# EAGLE design Wattuino-Nanite841_v10 (EAGLE 7.7.0)
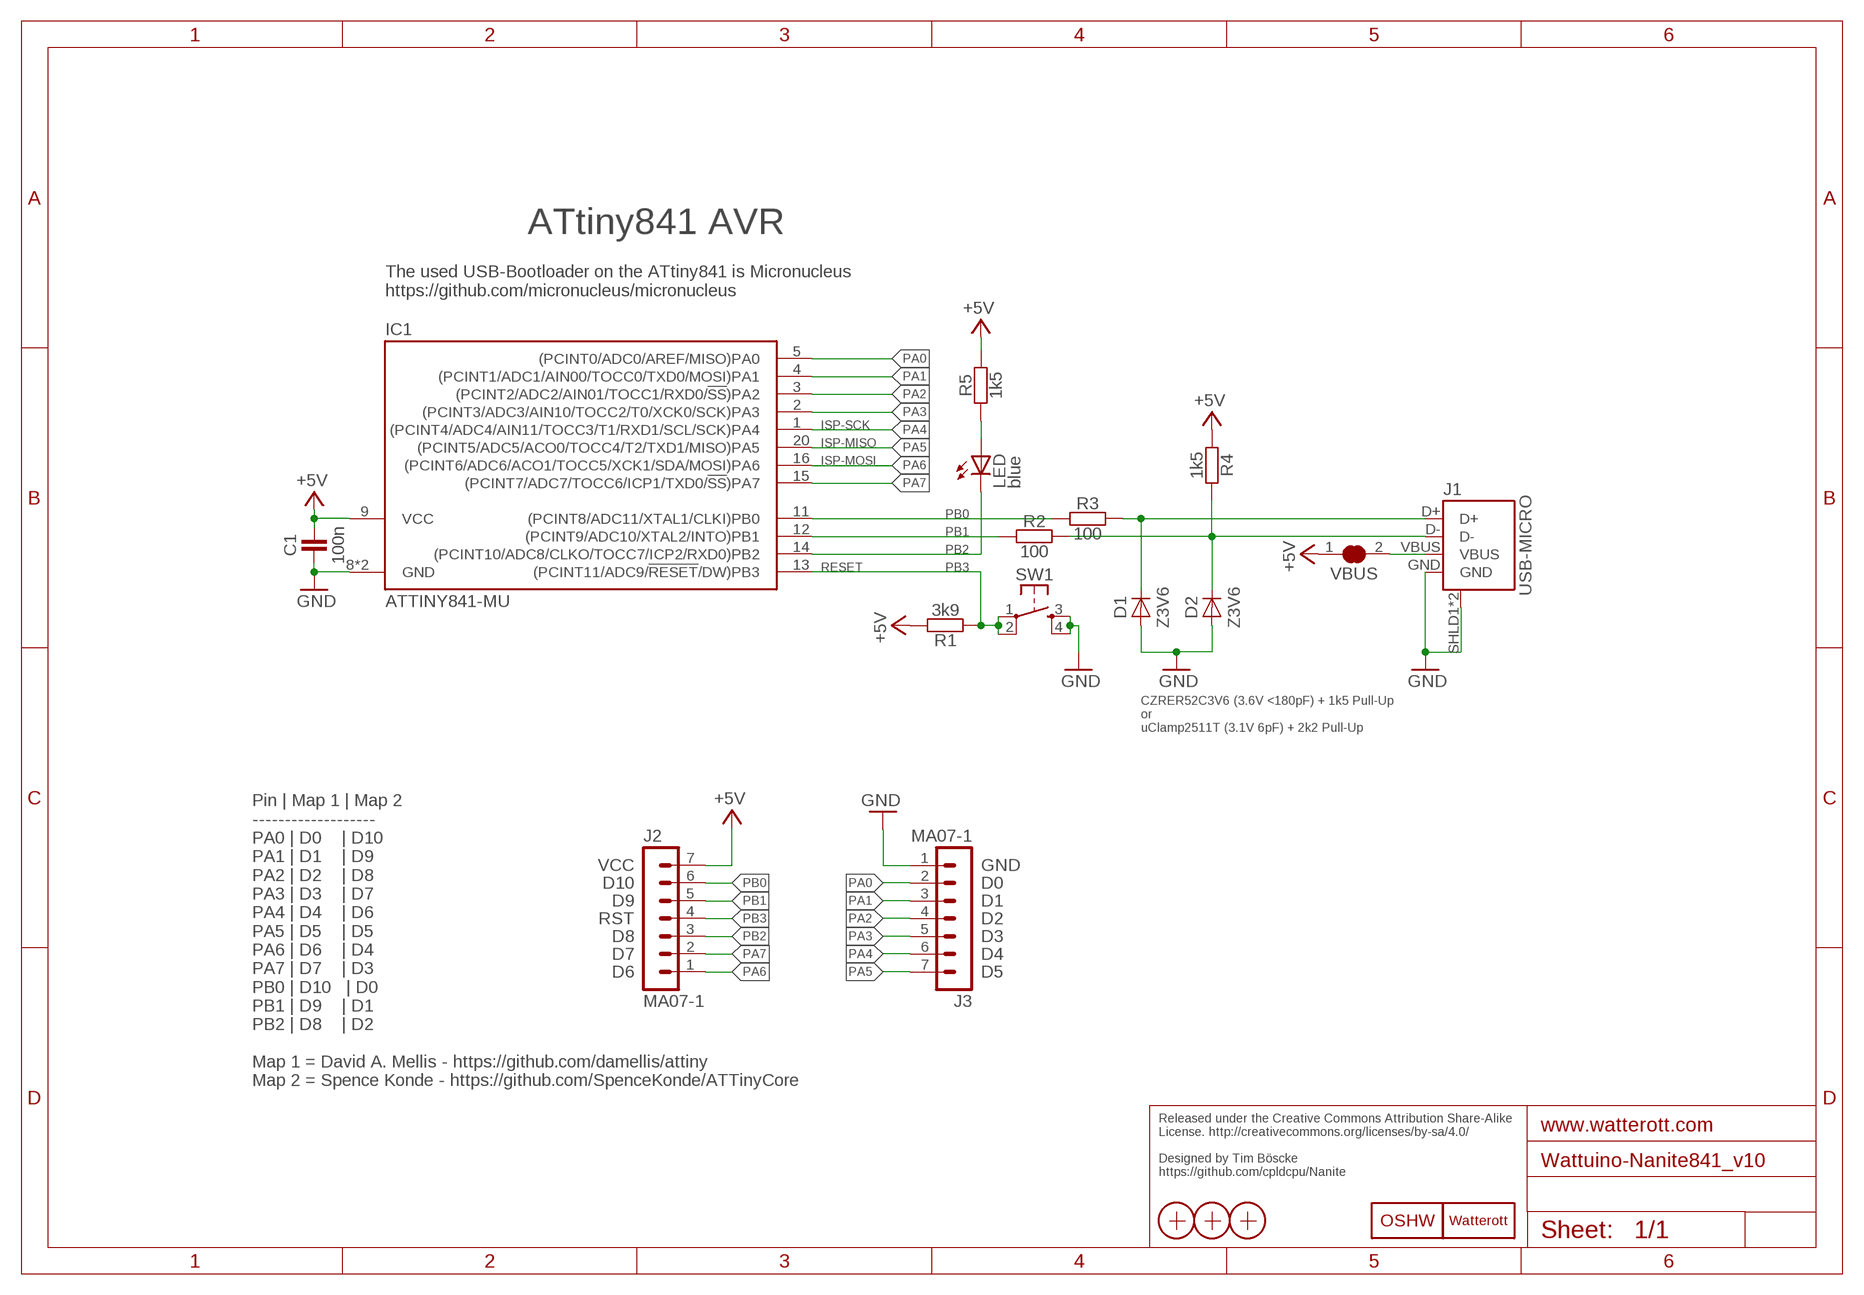
[diagram p0: schematic, sheet 1]

## Parts
C1  100n  CAPACITOR-0402  [C0402]
D1  Z3V6  DIODE-SOD882  [SOD882]
D2  Z3V6  DIODE-SOD882  [SOD882]
IC1  ATTINY841-MU  [QFN20-PAD]
J1  USB-MICRO  [USB-MICRO-10103594]
J2  MA07-1  [MA07-1]
J3  MA07-1  [MA07-1]
LED  blue  LED-0603  [C0603]
LOGO1  LOGO-S_PLACE_S  [SPARK_TPLACE_S]
LOGO2  OSHW_LOGOX0070  [OSHW_6X70]
R1  3k9  RESISTOR-0402  [C0402]
R2  100  RESISTOR-0402  [C0402]
R3  100  RESISTOR-0402  [C0402]
R4  1k5  RESISTOR-0402  [C0402]
R5  1k5  RESISTOR-0402  [C0402]
SW1  SW-TACTILE-PTS840P  [SW_PTS840P]
VBUS  JUMPER2-0603-NC  [JUMPER2-0603_NC]
X1  PASSER-07  [PASSER_07MM]
X2  PASSER-07  [PASSER_07MM]
X3  PASSER-07  [PASSER_07MM]

## Nets
+5V: C1.2 IC1.9(VCC) J2.7 R1.2 R4.1 R5.2 VBUS.1
D_N: D2.C J1.D- R2.2 R4.2
D_P: D1.C J1.D+ R3.2
GND: C1.1 D1.A D2.A IC1.8(GND) IC1.TP(GND) J1.GND J1.SHLD1(SHIELD) J1.SHLD2(SHIELD) J3.1 SW1.3(S1) SW1.4(S2)
LED+: LED.A R5.1
PA0: IC1.5((PCINT0/ADC0/AREF/MISO)PA0) J3.2
PA1: IC1.4((PCINT1/ADC1/AIN00/TOCC0/TXD0/MOSI)PA1) J3.3
PA2: IC1.3((PCINT2/ADC2/AIN01/TOCC1/RXD0/!SS!)PA2) J3.4
PA3: IC1.2((PCINT3/ADC3/AIN10/TOCC2/T0/XCK0/SCK)PA3) J3.5
PA4: IC1.1((PCINT4/ADC4/AIN11/TOCC3/T1/RXD1/SCL/SCK)PA4) J3.6
PA5: IC1.20((PCINT5/ADC5/ACO0/TOCC4/T2/TXD1/MISO)PA5) J3.7
PA6: IC1.16((PCINT6/ADC6/ACO1/TOCC5/XCK1/SDA/MOSI)PA6) J2.1
PA7: IC1.15((PCINT7/ADC7/TOCC6/ICP1/TXD0/!SS!)PA7) J2.2
PB0: IC1.11((PCINT8/ADC11/XTAL1/CLKI)PB0) J2.6 R3.1
PB1: IC1.12((PCINT9/ADC10/XTAL2/INTO)PB1) J2.5 R2.1
PB2: IC1.14((PCINT10/ADC8/CLKO/TOCC7/ICP2/RXD0)PB2) J2.3 LED.C
PB3: IC1.13((PCINT11/ADC9/!RESET!/DW)PB3) J2.4 R1.1 SW1.1 SW1.2
VBUS: J1.VBUS VBUS.2

## Notes on the sheet
- ATtiny841 AVR
- The used USB-Bootloader on the ATtiny841 is Micronucleus 
  https://github.com/micronucleus/micronucleus
- ISP-SCK
- ISP-MISO
- ISP-MOSI
- RESET
- CZRER52C3V6 (3.6V <180pF) + 1k5 Pull-Up 
  or
  uClamp2511T (3.1V 6pF) + 2k2 Pull-Up
- Pin | Map 1 | Map 2
  -------------------
  PA0 | D0    | D10
  PA1 | D1    | D9
  PA2 | D2    | D8
  PA3 | D3    | D7
  PA4 | D4    | D6
  PA5 | D5    | D5
  PA6 | D6    | D4
  PA7 | D7    | D3
  PB0 | D10   | D0
  PB1 | D9    | D1
  PB2 | D8    | D2
  
  Map 1 = David A. Mellis - https://github.com/damellis/attiny
  Map 2 = Spence Konde - https://github.com/SpenceKonde/ATTinyCore
- VCC | GND
- D10 | D0
- D9 | D1
- RST | D2
- D8 | D3
- D7 | D4
- D6 | D5
- Released under the Creative Commons Attribution Share-Alike 
  License. http://creativecommons.org/licenses/by-sa/4.0/
  
  Designed by Tim Böscke
  https://github.com/cpldcpu/Nanite

## Library data of the parts
C1 = we-rcl:CAPACITOR: Capacitors ...4.7uF @ 6.3V -> 0402 ...10uF @ 16V -> 0603 ...22uF @ 25V -> 0805
D1 D2 = we-rcl:DIODE: Diodes
IC1 = we-chip:ATTINY841: Atmel ATtiny441/841 AVR Microcontroller
J1 = we-con:USB: USB Connectors; DIGIKEY: 609-4050-6-ND
J2 J3 = we-con:MA07-1: Pin Header
LED = we-opto:LED: LEDs
LOGO1 = we-symbol:LOGO: Watterott electronic Logo
LOGO2 = we-symbol:OSHW_LOGO: Open-Source-Hardware Logo
R1-R5 = we-rcl:RESISTOR: Resistors all kinds in 0603 and 0402
SW1 = we-switch:SW-TACTILE: Tactile Switches; DIGIKEY: CKN10511DKR-ND
VBUS = we-rcl:JUMPER2: 2 Pin Jumpers
X1-X3 = we-symbol:PASSER: Fiducial Markers

## Board
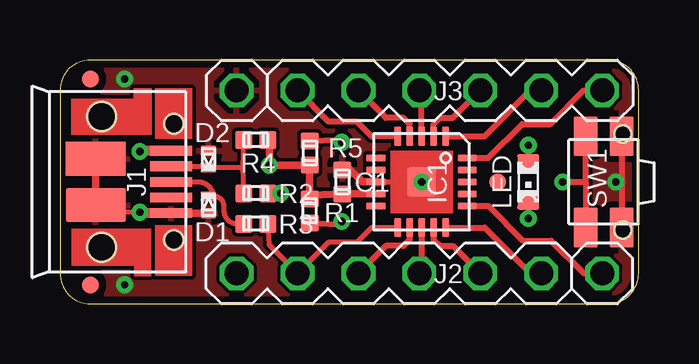
[diagram p1: board, top side]
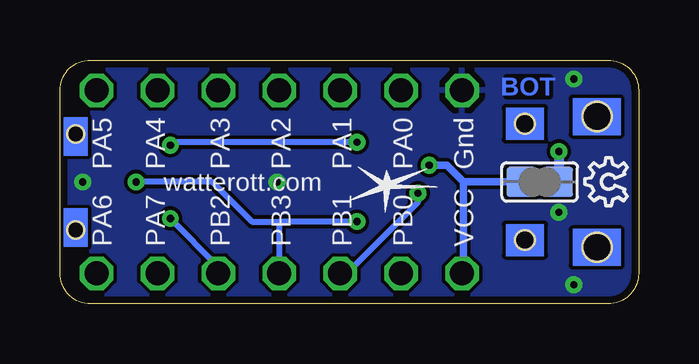
[diagram p2: board, bottom side, seen from below]

Size 24.13 x 10.16 mm. Coordinates in mm from the lower left corner, seen from the top.
Outline: 0,1.27 arc90 1.27,0 22.86,0 arc90 24.13,1.27 24.13,8.89 arc90 22.86,10.16 1.27,10.16 arc90 0,8.89 0,1.27
Copper layers (1*16): Top 0.035mm / dielectric 1.5mm / Bottom 0.035mm
Design rules "we-dru *": minimum track width 0.15mm, minimum drill 0.3mm, track to track 0.15mm, track to pad 0.15mm, pad to pad 0.15mm, via to via 0.15mm, smd to smd 0.1mm, copper to edge 0.3mm, drill to drill 0.2mm, minimum pad ring 0.18mm, minimum via ring 0.2mm, stop-mask expansion 0.1mm, vias tented up to drill 0.5mm, thermal gap 0.25mm

### Footprints (pad centres in the part's own frame; a part is rotated, then mirrored left to right if it is on the bottom)
C0402 = smd 0.75 x 0.7: 1 0,0.5; 2 0,-0.5
SOD882 = smd 0.65 x 0.4: A 0,-0.35; C 0,0.35
QFN20-PAD = smd 0.8 x 0.28: 1 -1.9,1; 2 -1.9,0.5; 3 -1.9,0; 4 -1.9,-0.5; 5 -1.9,-1; 11 1.9,-1; 12 1.9,-0.5; 13 1.9,0; 14 1.9,0.5; 15 1.9,1 | smd 0.28 x 0.8: 6 -1,-1.9; 7 -0.5,-1.9; 8 0,-1.9; 9 0.5,-1.9; 10 1,-1.9; 16 1,1.9; 17 0.5,1.9; 18 0,1.9; 19 -0.5,1.9; 20 -1,1.9 | smd 1.2 x 1.2: TP 0,0
USB-MICRO-10103594 = smd 1.8 x 0.4: D+ -2.885,0; D- -2.885,-0.65; GND -2.885,1.3; ID -2.885,0.65; VBUS -2.885,-1.3 | smd 2.5 x 1.425: SHLD1 0.25,-0.963; SHLD2 0.25,0.963 | hole 0.8: -3,2.425; -3,-2.425 | hole 1.2: 0.01,2.725; 0.01,-2.725
MA07-1 = drill 1 octagon: 1 0,7.62; 2 0,5.08; 3 0,2.54; 4 0,0; 5 0,-2.54; 6 0,-5.08; 7 0,-7.62
C0603 = smd 0.9 x 0.8: A 0,-0.75; C 0,0.75
SW_PTS840P = smd 1.65 x 1: 1 -1.9,0.75; 2 1.9,0.75; 3 -1.9,-0.75; 4 1.9,-0.75 | hole 0.7: -2,-0.8; 2,-0.8
JUMPER2-0603_NC = smd 1.25 x 1.25: 1 0,0.76; 2 0,-0.76
PASSER_07MM = smd 0.7 x 0.7: X 0,0

### Placement (x,y rotation side)
C1  11.77,5.08 0 top
D1  6.19,4.13 0 top
D2  6.19,6.03 180 top
IC1  15.08,5.08 270 top
J1  1.75,5.08 180 top
J2  14.99,1.27 270 top
J3  14.99,8.89 90 top
LED  19.53,5.08 180 top
LOGO1  10.48,4.92 0 bottom
LOGO2  0.48,4.1 90 bottom
R1  10.41,3.87 180 top
R2  8.16,4.6 270 top
R3  8.16,3.33 270 top
R4  8.16,6.83 270 top
R5  10.41,6.29 0 top
SW1  22.67,5.08 90 top
VBUS  4.13,5.08 90 bottom
X1  1.27,0.79 0 top
X2  1.27,9.37 0 top
X3  18.26,5.08 0 top

### Tracks (layer width: path | path; a pad name or v marks a point on that pad's centre or on a via)
+5V  (via drill 0.3 pad 0.25)
  Top 0.305: 10.52,4.53 C1.2 11.82,4.58 IC1.9 | 10.52,4.53 R1.2 | 10.52,4.53 10.41,4.64 R5.2 10.37,5.78 v8.73,5.78 8.73,6.8 R4.1
  Bottom 0.254: 7.3,1.27 J2.7
  Bottom 0.305: 7.3,1.27 7.3,5.08 | 7.3,5.08 VBUS.1 | v8.73,5.78 8,5.78 7.3,5.08
D_N
  Top 0.203: J1.D- 6.14,5.73 D2.C 7.61,5.68 | 7.61,5.68 R2.2 | R4.2 7.61,5.68
D_P
  Top 0.203: J1.D+ 5.78,5.08 arc-90 6.38,4.48 | 6.38,4.48 6.45,4.48 arc-90 6.83,4.1 6.83,3.9 arc90 7.4,3.33 R3.2 | D1.C 6.38,4.48 arc-90 6.38,4.48
GND  (via drill 0.3)
  Top 0.203: 6.17,3.76 D1.A | v3.33,3.81 1.8,3.81 J1.SHLD2 | IC1.8 IC1.TP
  Top 0.254: SW1.4 SW1.3
  Top 0.305: J1.SHLD2 J1.SHLD1 | 3.36,3.78 v3.33,3.81 | J1.GND D1.A | C1.1 12.05,5.63 12.61,5.08 IC1.8
  Top 0.406: J1.GND 3.36,3.78
  other vias: 23.18,5.08 15.08,5.08 2.7,0.79 2.7,9.37 15.08,5.08
  pour Top: 0,0 24.13,0 24.13,10.16 0,10.16
  pour Bottom: 0,0 24.13,0 24.13,10.16 0,10.16
LED+  (via drill 0.3 pad 0.25)
  Top 0.203: LED.A v19.53,6.6
  Top 0.254: R5.1 11.64,6.84 v11.75,6.73
  Bottom 0.254: v11.75,6.73 19.4,6.73 v19.53,6.6
PA0
  Top 0.254: IC1.5 12.99,6.98 12.38,7.59 11.21,7.59 J3.2
PA1
  Top 0.254: IC1.4 14.58,7.49 14.32,7.75 13.59,7.75 J3.3
PA2
  Top 0.254: IC1.3 15.08,8.79 J3.4
PA3
  Top 0.254: IC1.2 15.58,7.49 15.84,7.75 16.38,7.75 J3.5
PA4
  Top 0.254: IC1.1 17.71,6.98 19.62,8.89 J3.6
PA5
  Top 0.254: IC1.20 17.86,6.08 19.27,7.49 20.45,7.49 21.84,8.89 J3.7
PA6
  Top 0.254: IC1.16 17.86,4.08 19.3,2.63 20.48,2.63 21.84,1.27 J2.1
PA7
  Top 0.254: IC1.15 17.71,3.18 19.62,1.27 J2.2
PB0
  Top 0.203: R3.1 8.71,2.47 J2.6 11.21,2.57 12.38,2.57 12.99,3.18 IC1.11
PB1  (via drill 0.3 pad 0.25)
  Top 0.203: R2.1 v9.21,4.6
  Top 0.254: IC1.12 14.58,2.67 14.32,2.41 13.59,2.41 J2.5
  Bottom 0.254: v9.21,4.6 9.21,4.22 12.16,1.27 J2.5
PB2  (via drill 0.3 pad 0.25)
  Top 0.203: LED.C v19.53,3.56
  Top 0.254: J2.3 16.38,2.41 15.84,2.41 15.58,2.67 IC1.14
  Bottom 0.254: J2.3 17.53,1.56 v19.53,3.56
PB3  (via drill 0.3 pad 0.25)
  Top 0.254: R1.1 11.64,3.32 v11.75,3.43 | 21.92,5.08 SW1.1 | v20.95,5.08 21.92,5.08 | IC1.13 15.08,1.36 J2.4 | 21.92,5.08 SW1.2
  Bottom 0.254: v11.75,3.43 14.99,3.43 | v20.95,5.08 17.78,5.08 16.13,3.43 14.99,3.43 | 14.99,3.43 J2.4
VBUS  (via drill 0.3)
  Top 0.406: J1.VBUS 3.36,6.38 v3.33,6.35
  Bottom 0.203: 4.73,5.08 VBUS.2 3.33,5.08
  Bottom 0.406: v3.33,6.35 3.33,5.11 VBUS.2

### Text on the board
Bottom: BOT
bPlace: Gnd | PA0 | PA1 | PA2 | PA3 | PA4 | PA5 | watterott.com | VCC | PB0 | PB1 | PB3 | PB2 | PA7 | PA6
Reference: Silkscreen: 22 bPlace